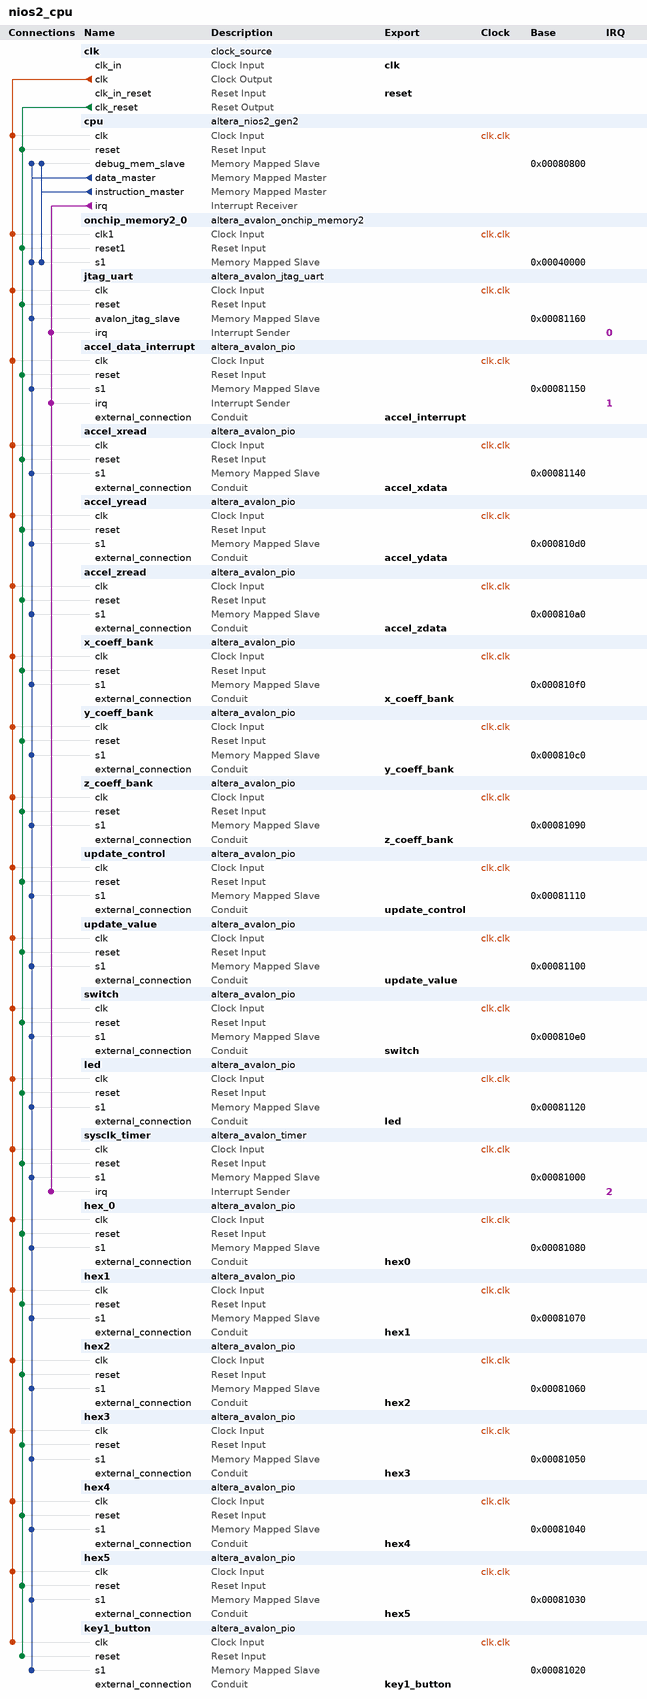
[diagram p0: system contents]
# Platform Designer (Qsys) system nios2_cpu, MAX 10 10M50DAF484C7G
# Parameters at their usual value, and those the tool derives, are not listed.
package require -exact qsys 20.1
create_system nios2_cpu
set_project_property DEVICE_FAMILY {MAX 10}
set_project_property DEVICE 10M50DAF484C7G

add_instance clk clock_source 20.1
set_instance_parameter_value clk clockFrequency 50000000

add_instance cpu altera_nios2_gen2 20.1
set_instance_parameter_value cpu dcache_size 2048
set_instance_parameter_value cpu exceptionSlave onchip_memory2_0.s1
set_instance_parameter_value cpu icache_size 4096
set_instance_parameter_value cpu impl Tiny
set_instance_parameter_value cpu resetSlave onchip_memory2_0.s1

add_instance onchip_memory2_0 altera_avalon_onchip_memory2 20.1
set_instance_parameter_value onchip_memory2_0 dataWidth 32
set_instance_parameter_value onchip_memory2_0 dualPort false
set_instance_parameter_value onchip_memory2_0 initMemContent false
set_instance_parameter_value onchip_memory2_0 initializationFileName onchip_mem.hex
set_instance_parameter_value onchip_memory2_0 memorySize 140000

add_instance jtag_uart altera_avalon_jtag_uart 20.1
set_instance_parameter_value jtag_uart simInteractiveOptions NO_INTERACTIVE_WINDOWS

add_instance accel_data_interrupt altera_avalon_pio 20.1
set_instance_parameter_value accel_data_interrupt captureEdge true
set_instance_parameter_value accel_data_interrupt direction Input
set_instance_parameter_value accel_data_interrupt generateIRQ true
set_instance_parameter_value accel_data_interrupt irqType EDGE
set_instance_parameter_value accel_data_interrupt width 1

add_instance accel_xread altera_avalon_pio 20.1
set_instance_parameter_value accel_xread direction Input
set_instance_parameter_value accel_xread width 16

add_instance accel_yread altera_avalon_pio 20.1
set_instance_parameter_value accel_yread direction Input
set_instance_parameter_value accel_yread width 16

add_instance accel_zread altera_avalon_pio 20.1
set_instance_parameter_value accel_zread direction Input
set_instance_parameter_value accel_zread width 16

add_instance x_coeff_bank altera_avalon_pio 20.1
set_instance_parameter_value x_coeff_bank direction Output
set_instance_parameter_value x_coeff_bank width 2

add_instance y_coeff_bank altera_avalon_pio 20.1
set_instance_parameter_value y_coeff_bank direction Output
set_instance_parameter_value y_coeff_bank width 2

add_instance z_coeff_bank altera_avalon_pio 20.1
set_instance_parameter_value z_coeff_bank direction Output
set_instance_parameter_value z_coeff_bank width 2

add_instance update_control altera_avalon_pio 20.1
set_instance_parameter_value update_control direction Output
set_instance_parameter_value update_control width 9

add_instance update_value altera_avalon_pio 20.1
set_instance_parameter_value update_value direction Output
set_instance_parameter_value update_value width 16

add_instance switch altera_avalon_pio 20.1
set_instance_parameter_value switch direction Input
set_instance_parameter_value switch width 10

add_instance led altera_avalon_pio 20.1
set_instance_parameter_value led direction Output
set_instance_parameter_value led width 10

add_instance sysclk_timer altera_avalon_timer 20.1
set_instance_parameter_value sysclk_timer period 1
set_instance_parameter_value sysclk_timer periodUnits MSEC

add_instance hex_0 altera_avalon_pio 20.1
set_instance_parameter_value hex_0 direction Output
set_instance_parameter_value hex_0 width 7

add_instance hex1 altera_avalon_pio 20.1
set_instance_parameter_value hex1 direction Output
set_instance_parameter_value hex1 width 7

add_instance hex2 altera_avalon_pio 20.1
set_instance_parameter_value hex2 direction Output
set_instance_parameter_value hex2 width 7

add_instance hex3 altera_avalon_pio 20.1
set_instance_parameter_value hex3 direction Output
set_instance_parameter_value hex3 width 7

add_instance hex4 altera_avalon_pio 20.1
set_instance_parameter_value hex4 direction Output
set_instance_parameter_value hex4 width 7

add_instance hex5 altera_avalon_pio 20.1
set_instance_parameter_value hex5 direction Output
set_instance_parameter_value hex5 width 7

add_instance key1_button altera_avalon_pio 20.1
set_instance_parameter_value key1_button direction Input
set_instance_parameter_value key1_button width 2

# connections
add_connection clk.clk accel_data_interrupt.clk clock
add_connection clk.clk accel_xread.clk clock
add_connection clk.clk accel_yread.clk clock
add_connection clk.clk accel_zread.clk clock
add_connection clk.clk cpu.clk clock
add_connection clk.clk hex1.clk clock
add_connection clk.clk hex2.clk clock
add_connection clk.clk hex3.clk clock
add_connection clk.clk hex4.clk clock
add_connection clk.clk hex5.clk clock
add_connection clk.clk hex_0.clk clock
add_connection clk.clk jtag_uart.clk clock
add_connection clk.clk key1_button.clk clock
add_connection clk.clk led.clk clock
add_connection clk.clk onchip_memory2_0.clk1 clock
add_connection clk.clk switch.clk clock
add_connection clk.clk sysclk_timer.clk clock
add_connection clk.clk update_control.clk clock
add_connection clk.clk update_value.clk clock
add_connection clk.clk x_coeff_bank.clk clock
add_connection clk.clk y_coeff_bank.clk clock
add_connection clk.clk z_coeff_bank.clk clock
add_connection clk.clk_reset accel_data_interrupt.reset reset
add_connection clk.clk_reset accel_xread.reset reset
add_connection clk.clk_reset accel_yread.reset reset
add_connection clk.clk_reset accel_zread.reset reset
add_connection clk.clk_reset cpu.reset reset
add_connection clk.clk_reset hex1.reset reset
add_connection clk.clk_reset hex2.reset reset
add_connection clk.clk_reset hex3.reset reset
add_connection clk.clk_reset hex4.reset reset
add_connection clk.clk_reset hex5.reset reset
add_connection clk.clk_reset hex_0.reset reset
add_connection clk.clk_reset jtag_uart.reset reset
add_connection clk.clk_reset key1_button.reset reset
add_connection clk.clk_reset led.reset reset
add_connection clk.clk_reset onchip_memory2_0.reset1 reset
add_connection clk.clk_reset switch.reset reset
add_connection clk.clk_reset sysclk_timer.reset reset
add_connection clk.clk_reset update_control.reset reset
add_connection clk.clk_reset update_value.reset reset
add_connection clk.clk_reset x_coeff_bank.reset reset
add_connection clk.clk_reset y_coeff_bank.reset reset
add_connection clk.clk_reset z_coeff_bank.reset reset
add_connection cpu.data_master accel_data_interrupt.s1 avalon
set_connection_parameter_value cpu.data_master/accel_data_interrupt.s1 baseAddress 0x00081150
add_connection cpu.data_master accel_xread.s1 avalon
set_connection_parameter_value cpu.data_master/accel_xread.s1 baseAddress 0x00081140
add_connection cpu.data_master accel_yread.s1 avalon
set_connection_parameter_value cpu.data_master/accel_yread.s1 baseAddress 0x000810d0
add_connection cpu.data_master accel_zread.s1 avalon
set_connection_parameter_value cpu.data_master/accel_zread.s1 baseAddress 0x000810a0
add_connection cpu.data_master cpu.debug_mem_slave avalon
set_connection_parameter_value cpu.data_master/cpu.debug_mem_slave baseAddress 0x00080800
add_connection cpu.data_master hex1.s1 avalon
set_connection_parameter_value cpu.data_master/hex1.s1 baseAddress 0x00081070
add_connection cpu.data_master hex2.s1 avalon
set_connection_parameter_value cpu.data_master/hex2.s1 baseAddress 0x00081060
add_connection cpu.data_master hex3.s1 avalon
set_connection_parameter_value cpu.data_master/hex3.s1 baseAddress 0x00081050
add_connection cpu.data_master hex4.s1 avalon
set_connection_parameter_value cpu.data_master/hex4.s1 baseAddress 0x00081040
add_connection cpu.data_master hex5.s1 avalon
set_connection_parameter_value cpu.data_master/hex5.s1 baseAddress 0x00081030
add_connection cpu.data_master hex_0.s1 avalon
set_connection_parameter_value cpu.data_master/hex_0.s1 baseAddress 0x00081080
add_connection cpu.data_master jtag_uart.avalon_jtag_slave avalon
set_connection_parameter_value cpu.data_master/jtag_uart.avalon_jtag_slave baseAddress 0x00081160
add_connection cpu.data_master key1_button.s1 avalon
set_connection_parameter_value cpu.data_master/key1_button.s1 baseAddress 0x00081020
add_connection cpu.data_master led.s1 avalon
set_connection_parameter_value cpu.data_master/led.s1 baseAddress 0x00081120
add_connection cpu.data_master onchip_memory2_0.s1 avalon
set_connection_parameter_value cpu.data_master/onchip_memory2_0.s1 baseAddress 0x00040000
add_connection cpu.data_master switch.s1 avalon
set_connection_parameter_value cpu.data_master/switch.s1 baseAddress 0x000810e0
add_connection cpu.data_master sysclk_timer.s1 avalon
set_connection_parameter_value cpu.data_master/sysclk_timer.s1 baseAddress 0x00081000
add_connection cpu.data_master update_control.s1 avalon
set_connection_parameter_value cpu.data_master/update_control.s1 baseAddress 0x00081110
add_connection cpu.data_master update_value.s1 avalon
set_connection_parameter_value cpu.data_master/update_value.s1 baseAddress 0x00081100
add_connection cpu.data_master x_coeff_bank.s1 avalon
set_connection_parameter_value cpu.data_master/x_coeff_bank.s1 baseAddress 0x000810f0
add_connection cpu.data_master y_coeff_bank.s1 avalon
set_connection_parameter_value cpu.data_master/y_coeff_bank.s1 baseAddress 0x000810c0
add_connection cpu.data_master z_coeff_bank.s1 avalon
set_connection_parameter_value cpu.data_master/z_coeff_bank.s1 baseAddress 0x00081090
add_connection cpu.instruction_master cpu.debug_mem_slave avalon
set_connection_parameter_value cpu.instruction_master/cpu.debug_mem_slave baseAddress 0x00080800
add_connection cpu.instruction_master onchip_memory2_0.s1 avalon
set_connection_parameter_value cpu.instruction_master/onchip_memory2_0.s1 baseAddress 0x00040000
add_connection cpu.irq accel_data_interrupt.irq interrupt
set_connection_parameter_value cpu.irq/accel_data_interrupt.irq irqNumber 1
add_connection cpu.irq jtag_uart.irq interrupt
set_connection_parameter_value cpu.irq/jtag_uart.irq irqNumber 0
add_connection cpu.irq sysclk_timer.irq interrupt
set_connection_parameter_value cpu.irq/sysclk_timer.irq irqNumber 2

# exported interfaces
add_interface accel_interrupt conduit end
set_interface_property accel_interrupt EXPORT_OF accel_data_interrupt.external_connection
add_interface accel_xdata conduit end
set_interface_property accel_xdata EXPORT_OF accel_xread.external_connection
add_interface accel_ydata conduit end
set_interface_property accel_ydata EXPORT_OF accel_yread.external_connection
add_interface accel_zdata conduit end
set_interface_property accel_zdata EXPORT_OF accel_zread.external_connection
add_interface clk clock sink
set_interface_property clk EXPORT_OF clk.clk_in
add_interface hex0 conduit end
set_interface_property hex0 EXPORT_OF hex_0.external_connection
add_interface hex1 conduit end
set_interface_property hex1 EXPORT_OF hex1.external_connection
add_interface hex2 conduit end
set_interface_property hex2 EXPORT_OF hex2.external_connection
add_interface hex3 conduit end
set_interface_property hex3 EXPORT_OF hex3.external_connection
add_interface hex4 conduit end
set_interface_property hex4 EXPORT_OF hex4.external_connection
add_interface hex5 conduit end
set_interface_property hex5 EXPORT_OF hex5.external_connection
add_interface key1_button conduit end
set_interface_property key1_button EXPORT_OF key1_button.external_connection
add_interface led conduit end
set_interface_property led EXPORT_OF led.external_connection
add_interface reset reset sink
set_interface_property reset EXPORT_OF clk.clk_in_reset
add_interface switch conduit end
set_interface_property switch EXPORT_OF switch.external_connection
add_interface update_control conduit end
set_interface_property update_control EXPORT_OF update_control.external_connection
add_interface update_value conduit end
set_interface_property update_value EXPORT_OF update_value.external_connection
add_interface x_coeff_bank conduit end
set_interface_property x_coeff_bank EXPORT_OF x_coeff_bank.external_connection
add_interface y_coeff_bank conduit end
set_interface_property y_coeff_bank EXPORT_OF y_coeff_bank.external_connection
add_interface z_coeff_bank conduit end
set_interface_property z_coeff_bank EXPORT_OF z_coeff_bank.external_connection

set_interconnect_requirement {$system} qsys_mm.clockCrossingAdapter HANDSHAKE
set_interconnect_requirement {$system} qsys_mm.enableEccProtection FALSE
set_interconnect_requirement {$system} qsys_mm.insertDefaultSlave FALSE
set_interconnect_requirement {$system} qsys_mm.maxAdditionalLatency 1

save_system nios2_cpu.qsys
